# Altium schematic sheet MOTOR_DRIVERS2.SchDoc
size A4
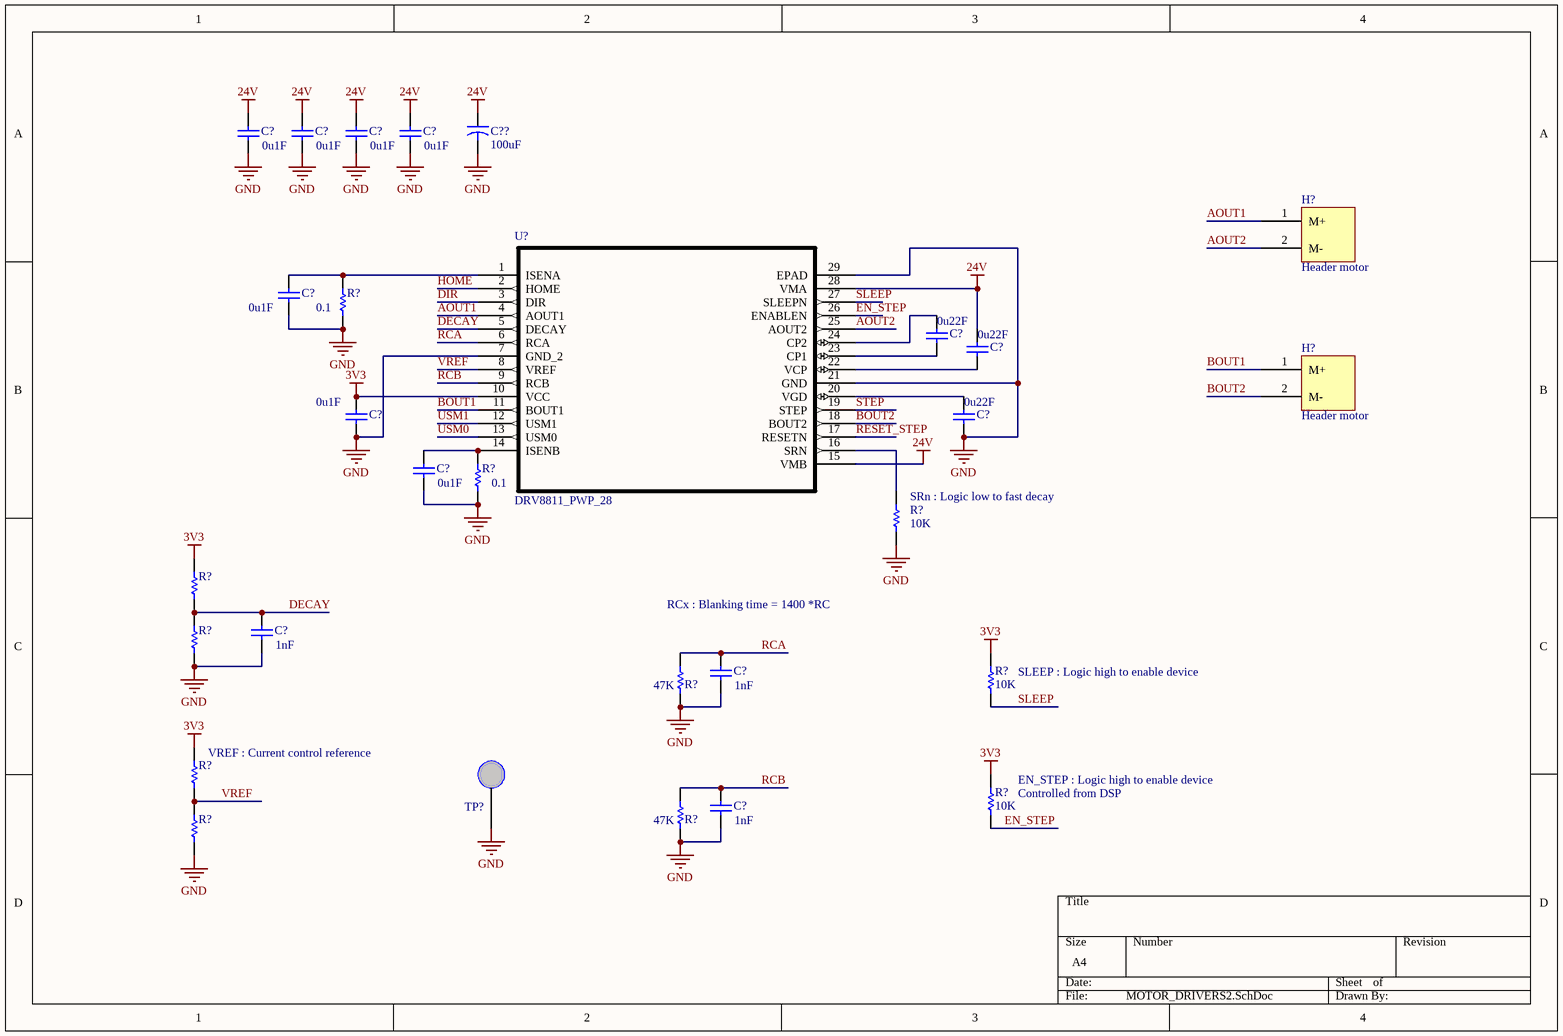
[diagram p0: MOTOR_DRIVERS2.SchDoc]

## Parts
(Parts that share a designator on the sheet are numbered #1, #2 ... from top to bottom, then left to right.)
C?#1  value 0u1F  [0603]  (hidden comment: C0603)
C?#2  value 0u1F  [0603]  (hidden comment: C0603)
C?#3  value 0u1F  [0603]  (hidden comment: C0603)
C?#4  value 0u1F  [0603]  (hidden comment: C0603)
C?#5  value 0u1F  [0603]  (hidden comment: C0603)
C?#6  value 0u22F  [0603]  (hidden comment: C0603)
C?#7  value 0u22F  [0603]  (hidden comment: C0603)
C?#8  value 0u1F  [0603]  (hidden comment: C0603)
C?#9  value 0u22F  [0603]  (hidden comment: C0603)
C?#10  value 0u1F  [0603]  (hidden comment: C0603)
C?#11  value 1nF  [0603]  (hidden comment: C0603)
C?#12  value 1nF  [0603]  (hidden comment: C0603)
C?#13  value 1nF  [0603]  (hidden comment: C0603)
C??  100uF
H?#1  Header motor  [Header_motor_WEID]
H?#2  Header motor  [Header_motor_WEID]
R?#1  value 0.1  [8RB-1206]  (hidden comment: 1206)
R?#2  value 0.1  [8RB-1206]  (hidden comment: 1206)
R?#3  10K  [R0805]
R?#4  (no value)  [R0805]
R?#5  (no value)  [R0805]
R?#6  47K  [R0805]
R?#7  10K  [R0805]
R?#8  (no value)  [R0805]
R?#9  10K  [R0805]
R?#10  47K  [R0805]
R?#11  (no value)  [R0805]
TP?  5003K  [5003K]  (value not drawn)
U?  DRV8811_PWP_28  [PWP28_5P18X3P1-M]

## Nets
3V3: C?#8.2 R?#4.1 R?#7.1 R?#8.1 R?#9.1 U?.10(VCC)
24V: C?#1.2 C?#2.2 C?#3.2 C?#4.2 C?#7.2 C??.1 U?.15(VMB) U?.28(VMA)
GND: C?#1.1 C?#2.1 C?#3.1 C?#4.1 C?#5.1 C?#8.1 C?#9.1 C?#10.1 C?#11.1 C?#12.1 C?#13.1 C??.2 R?#1.1 R?#2.1 R?#3.2 R?#5.2 R?#6.1 R?#10.1 R?#11.2 TP?.1 U?.7(GND_2) U?.21(GND) U?.29(EPAD)
AOUT1: H?#1.1(M+) U?.4(AOUT1)
AOUT2: H?#1.2(M-) U?.25(AOUT2)
BOUT1: H?#2.1(M+) U?.11(BOUT1)
BOUT2: H?#2.2(M-) U?.18(BOUT2)
DECAY: C?#11.2 R?#4.2 R?#5.1 U?.5(DECAY)
DIR: U?.3(DIR)
EN_STEP: R?#9.2 U?.26(ENABLEN)
HOME: U?.2(HOME)
RCA: C?#12.2 R?#6.2 U?.6(RCA)
RCB: C?#13.2 R?#10.2 U?.9(RCB)
RESET_STEP: U?.17(RESETN)
SLEEP: R?#7.2 U?.27(SLEEPN)
STEP: U?.19(STEP)
USM0: U?.13(USM0)
USM1: U?.12(USM1)
VREF: R?#8.2 R?#11.1 U?.8(VREF)
NetC?#5_2: C?#5.2 R?#1.2 U?.1(ISENA)
NetC?#6_1: C?#6.1 U?.23(CP1)
NetC?#6_2: C?#6.2 U?.24(CP2)
NetC?#7_1: C?#7.1 U?.22(VCP)
NetC?#9_2: C?#9.2 U?.20(VGD)
NetC?#10_2: C?#10.2 R?#2.2 U?.14(ISENB)
NetR?#3_1: R?#3.1 U?.16(SRN)

## Notes on the sheet
- (near R?#3) SRn : Logic low to fast decay
- RCx : Blanking time = 1400 *RC
- (near R?#7) SLEEP : Logic high to enable device
- (near R?#8) VREF : Current control reference
- (near R?#9) EN_STEP : Logic high to enable device
- (near R?#9) Controlled from DSP

## Library data of the parts
C?#1-C?#13 = C0603: Ceramic Chip Capacitor - Standard; Note: Footprint corresponds to dimensions for bulk cassette packaging. This case size has tightened tolerances.; Published: 17-Jul-2002; LatestRevisionDate: 19-Mar-2004; LatestRevisionNote: Silkscreen size reduced.; DatasheetDocument: Mar-2001; PackageDocument: Mar-2001; PackageReference: 0603; Publisher: Altium Limited; Code_JEITA: 0603; Code_IPC: 1608 [0603]; ComponentLink1Description: Manufacturer Link; ComponentLink1URL: http://www.kemet.com/; ComponentLink2Description: Datasheet; ComponentLink2URL: http://www.kemet.com/kemet/web/homepage/kechome.nsf/vapubfilesname/F3102TA.pdf/$file/F3102TA.pdf
C?? = CAP_STEP
H?#1 H?#2 = Header motor: Connecteurs moteur; Manufacturer number: LS 5.08/02/90 3.5SN OR BX
R?#1 R?#2 = ERJ8RS: Low Ohmic Value Thick Film Chip Resistor, 0.1 Ohm to 0.2 Ohm Range, 1%, 2% and 5% Tolerance, 1206 Size, 0.25 W; Published: 17-Dec-2003; LatestRevisionDate: 19-Mar-2004; LatestRevisionNote: Silkscreen size reduced.; PackageDocument: Mar-2003; PackageReference: 8RB-1206; Publisher: Altium Limited; Code_IPC: 3216 [1206]; ComponentLink1Description: Manufacturer Link; ComponentLink1URL: http://www.panasonic.com/industrial/components/resistive_products.htm; ComponentLink2Description: Datasheet; ComponentLink2URL: http://www.panasonic.com/industrial/components/pdf/AOA0000CE3.pdf
R?#3-R?#11 = R0805: Resistor 0805
TP? = Testpoint: Testpoint for power
U? = DRV8811_PWP_28: Imported; Manufacturer: Texas Instruments; INDUSTRY_STD_PKG_TYPE: HTSSOP; FAMILY_NAME: STEPPER DRIVER; PIN_COUNT: 28; PACKAGE_DESIGNATOR: PWP; Datasheet URL: http://www.ti.com/lit/gpn/DRV8811; GENERIC_PART_NUMBER: DRV8811; VENDOR: Texas Instruments; MANUFACTURER_PART_NUMBER: drv8811_pwp_28